# EAGLE design TMP006 (EAGLE 7.7.0)
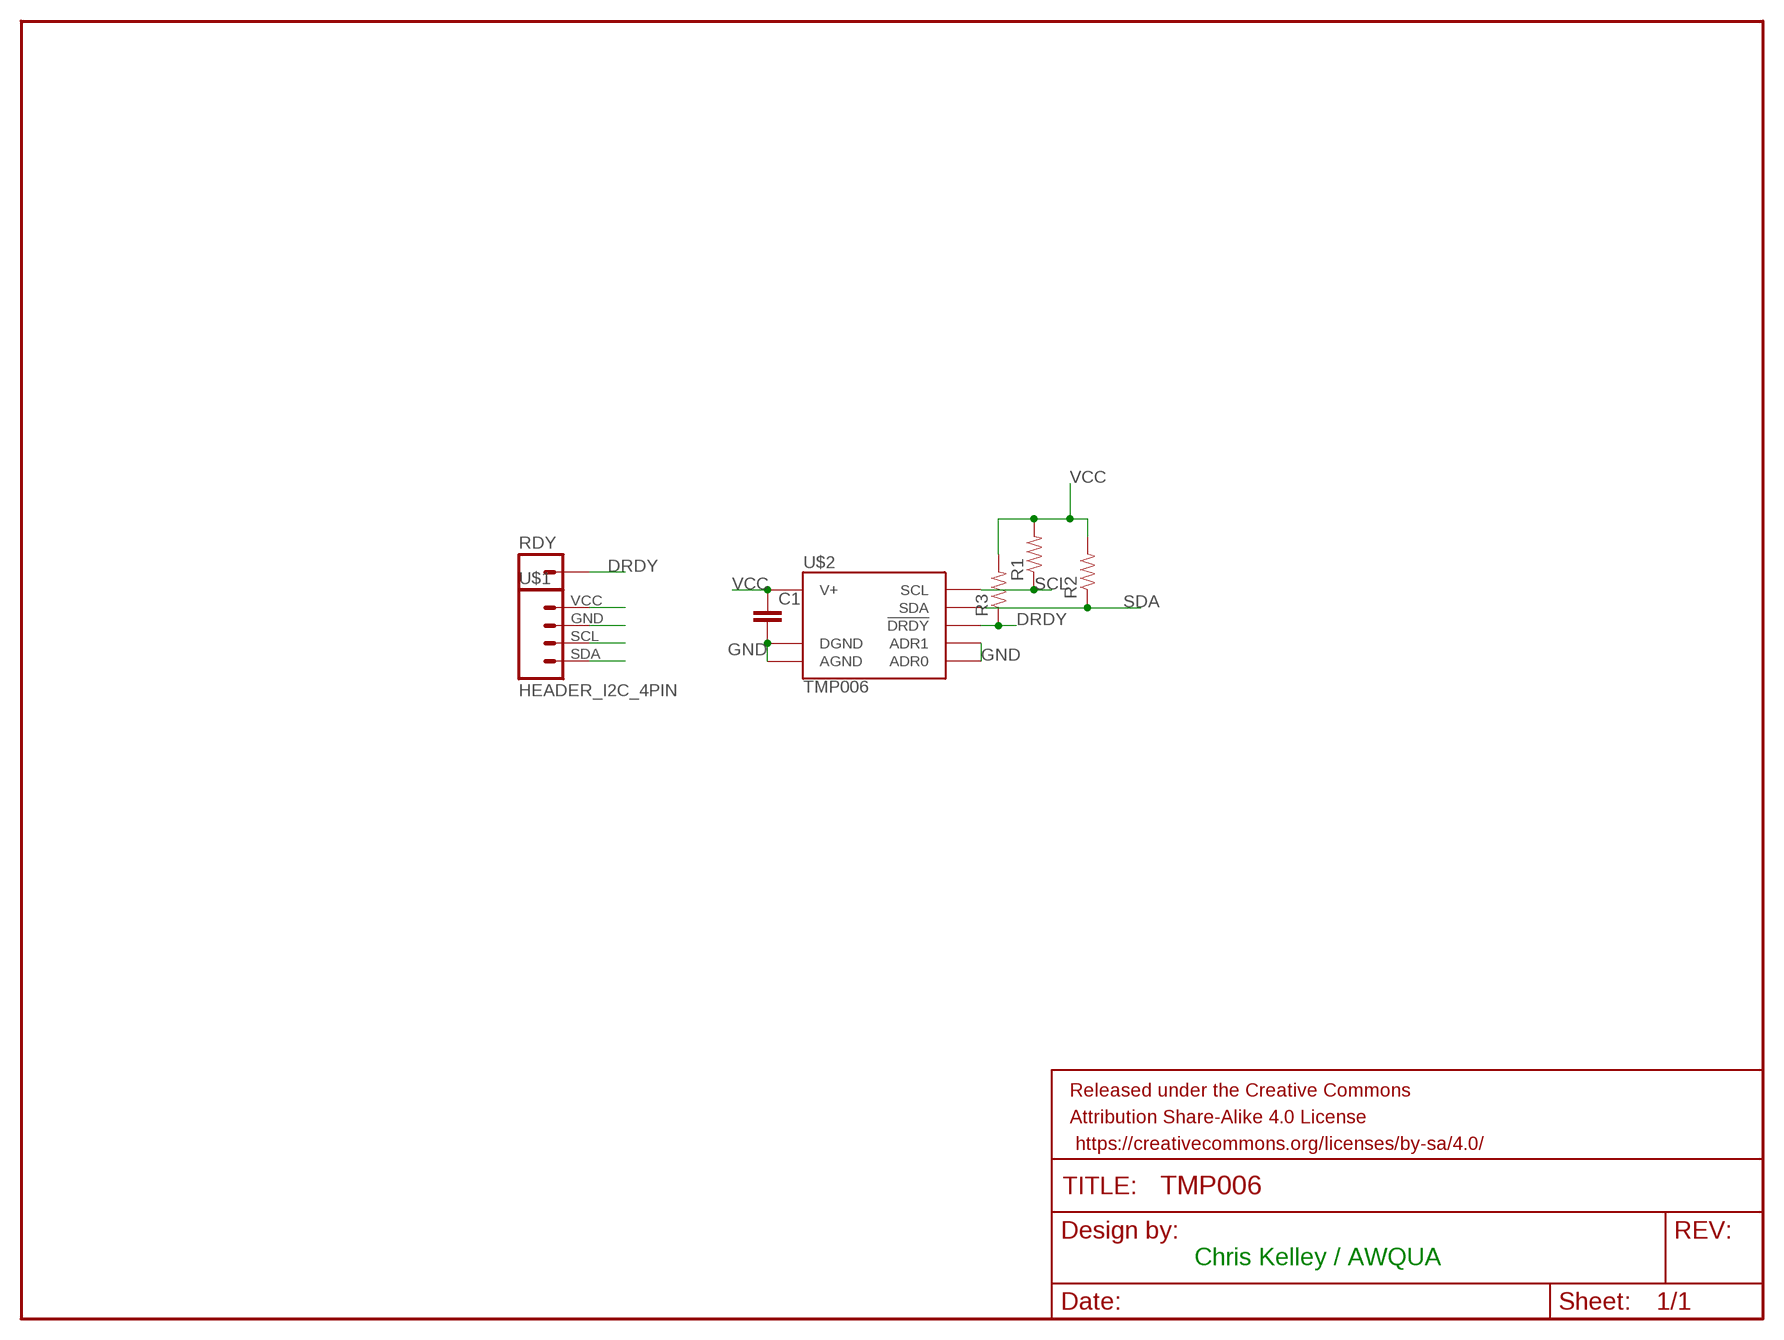
[diagram p0: schematic, sheet 1]

## Parts
C1  CAP0603-CAP  [0603-CAP]
FRAME1  FRAME-LETTER  [CREATIVE_COMMONS]
R1  RESISTOR0603-RES  [0603-RES]
R2  RESISTOR0603-RES  [0603-RES]
R3  RESISTOR0603-RES  [0603-RES]
RDY  M01PTH  [1X01]
U$1  HEADER_I2C_4PIN  [HEADER_I2C_4PIN]
U$2  TMP006  [TMP006]

## Nets
DRDY: R3.1 RDY.1 U$2.DRDY(!DRDY)
GND: C1.2 U$1.GND U$2.ADR0 U$2.ADR1 U$2.AGND U$2.DGND
SCL: R1.1 U$1.SCL U$2.SCL
SDA: R2.1 U$1.SDA U$2.SDA
VCC: C1.1 R1.2 R2.2 R3.2 U$1.VCC U$2.VCC(V+)

## Notes on the sheet
- Chris Kelley / AWQUA

## Library data of the parts
C1 = SparkFun-Passives:CAP: Capacitor Standard 0603 ceramic capacitor, and 0.1" leaded capacitor.
FRAME1 = SparkFun-Aesthetics:FRAME-LETTER: Schematic Frame Standard 8.5x11 US Letter frame
R1-R3 = SparkFun-Passives:RESISTOR: Resistor Basic schematic elements and footprints for 0603, 1206, and PTH resistors.
RDY = SparkFun-Connectors:M01: Header 1 Standard 1-pin 0.1" header. Use with straight break away headers (SKU : PRT-00116), right angle break away headers (PRT-00553), swiss pins (PRT-00743), machine pins (PRT-00117), and female headers (PRT-00115).
U$1 = awqua_eagle_library:HEADER_I2C_4PIN
U$2 = awqua_eagle_library:TMP006

## Board
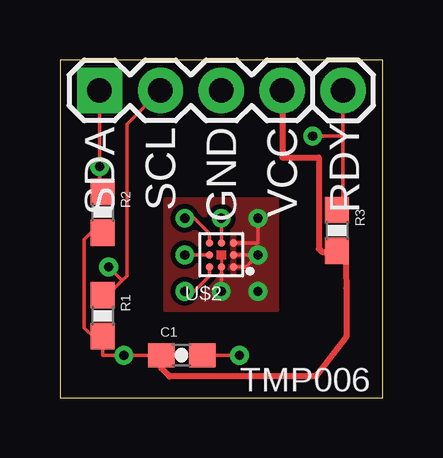
[diagram p1: board, top side]
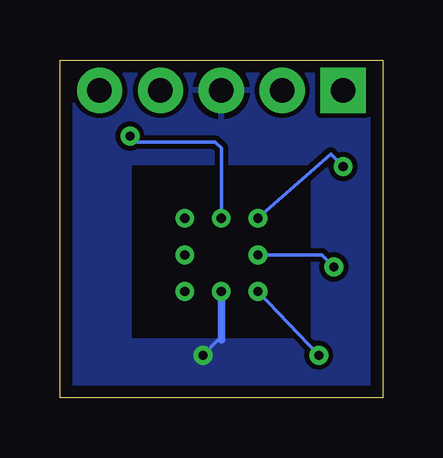
[diagram p2: board, bottom side, seen from below]

Size 13.46 x 14.1 mm. Coordinates in mm from the lower left corner, seen from the top.
Outline: 0,14.1 0,0 13.46,0 13.46,14.1 0,14.1
Copper layers (1*16): Top 0.035mm / dielectric 1.5mm / Bottom 0.035mm
Design rules "default *": minimum track width 10mil, minimum drill 24mil, track to track 8mil, track to pad 8mil, pad to pad 8mil, via to via 8mil, smd to smd 8mil, copper to edge 20mil, drill to drill 8mil, minimum pad ring 10mil, minimum via ring 8mil, stop-mask expansion 4mil, vias tented up to drill 0mil, thermal gap 10mil

### Footprints (pad centres in the part's own frame; a part is rotated, then mirrored left to right if it is on the bottom)
0603-CAP = smd 1.1 x 1: 1 -0.85,0; 2 0.85,0
0603-RES = smd 1.1 x 1: 1 -0.85,0; 2 0.85,0
1X01 = drill 1.016 pad 1.88: 1 0,0
HEADER_I2C_4PIN = drill 1.016 pad 1.88: GND 0,5.08; SCL 0,2.54; VCC 0,7.62 | drill 1.016 pad 1.88 square: SDA 0,0
TMP006 = smd 0.305 x 0.305: ADR0 -0.5,-0.5; ADR1 -0.5,0; AGND 0,0.5; DGND -0.5,0.5; DRDY 0,-0.5; SCL 0.5,0; SDA 0.5,-0.5; VCC 0.5,0.5

### Placement (x,y rotation side)
C1  5.08,1.78 0 top
FRAME1  13.97,-15.24 0 top  (outside the outline)
R1  1.78,3.43 270 top
R2  1.78,7.75 270 top
R3  11.56,6.99 270 top
RDY  11.81,12.83 270 top
U$1  1.65,12.83 270 top
U$2  6.73,5.97 180 top

### Tracks (layer width: path | path; a pad name or v marks a point on that pad's centre or on a via)
DRDY  (via drill 0.38)
  Top 0.152: RDY.1 11.81,10.92 | 11.81,10.92 11.81,7.83 | U$2.DRDY v6.73,7.49 | v10.54,10.92 11.81,10.92
  Top 0.254: 11.81,7.83 R3.1
  Bottom 0.152: v6.73,7.49 6.73,10.41 6.99,10.67 10.29,10.67 v10.54,10.92
GND  (via drill 0.38)
  Top 0.152: 7.36,5.47 U$2.DGND 7.75,5.47 v8.26,5.97 U$2.ADR1 | U$2.AGND v6.73,4.45 | C1.2 v7.49,1.78 | U$2.ADR0 8.25,6.47 8.26,6.48 v8.26,7.49
  Bottom 0.152: 7.24,2.03 v7.49,1.78 6.86,2.41 6.73,2.41
  Bottom 0.305: v6.73,4.45 6.73,2.41
  other vias: 8.26,4.45
  pour Top: 4.45,3.68 4.45,8.26 9.02,8.26 9.02,3.68
  pour Bottom: -0.13,14.1 13.59,14.1 13.59,0 6.86,0 6.86,2.41 10.54,2.41 10.54,9.78 2.92,9.78 2.92,2.41 6.73,2.41 6.73,0 -0.13,0
SCL  (via drill 0.38)
  Top 0.152: U$2.SCL v5.21,5.97 | R1.1 1.99,4.28 2.6,4.89 | 2.6,4.89 2.79,5.08 2.79,11.43 U$1.SCL | v2.03,5.46 2.6,4.89
  Bottom 0.152: v5.21,5.97 2.54,5.97 v2.03,5.46
SDA  (via drill 0.38)
  Top 0.152: U$2.SDA 6.23,6.85 5.59,7.49 v5.21,7.49 | R2.1 1.65,8.72 v1.65,9.65 U$1.SDA
  Bottom 0.152: v5.21,7.49 2.16,10.16 v1.65,9.65
VCC  (via drill 0.38)
  Top 0.152: U$2.VCC 6.23,5.09 5.59,4.45 v5.21,4.45 | R2.2 1.31,6.9 1.02,6.6 1.02,2.92 1.4,2.54 1.61,2.54 R1.2 1.78,1.78 v2.67,1.78 C1.1
  Top 0.254: C1.1 4.23,1.23 4.57,0.89 10.67,0.89 11.94,2.54 11.94,4.57 11.9,6.13 R3.2 11.52,6.1 10.92,6.1 10.79,6.22 10.79,10.03 9.27,10.03 U$1.VCC
  Bottom 0.152: v5.21,4.45 v2.67,1.78

### Text on the board
tNames: TMP006